# EAGLE design Charger_18V-1.35A_СС (EAGLE 8.5.0)
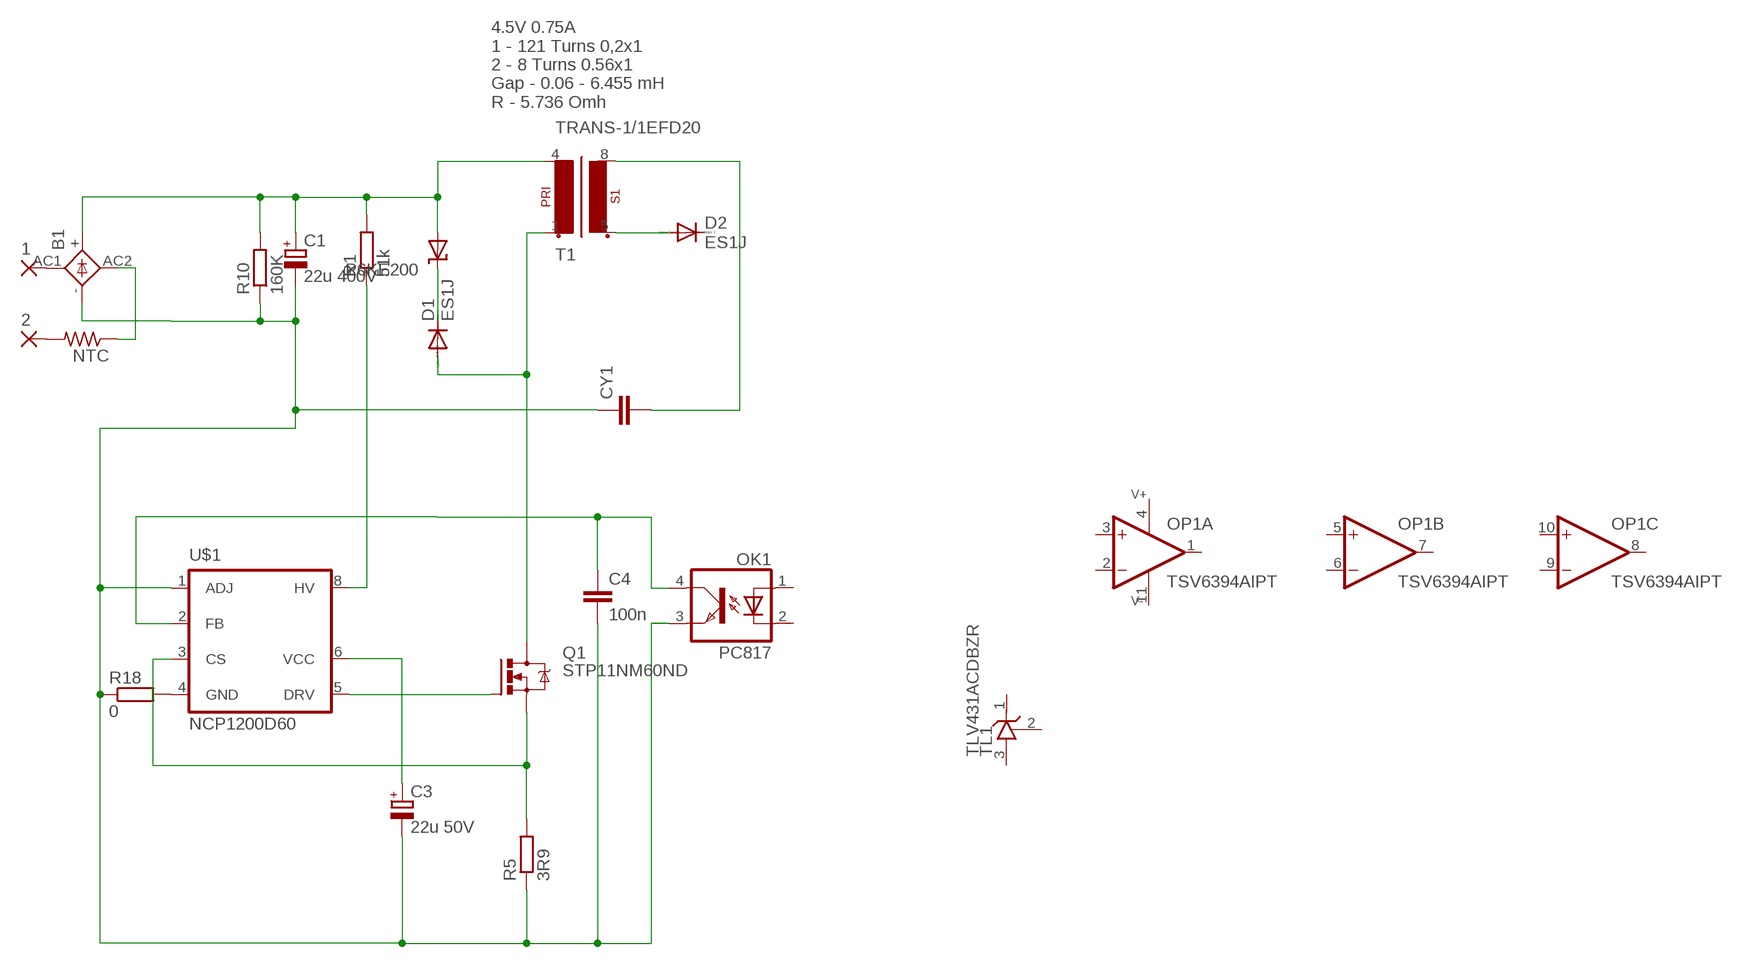
[diagram p0: schematic, sheet 1]

## Parts
1  3,81/1,4  [3,81/1,4]
2  3,81/1,4  [3,81/1,4]
B1  BRIDGEDBS  [DBS]
C1  22u 400V  CPOL-EUE7.5-18  [E7,5-18]
C3  22u 50V  CPOL-EUE5-5  [E5-5]
C4  100n  C-EUC0805  [C0805]
CY1  CYYC10B4  [YC10B4]
D1  ES1J  DIODE-DO-214AC  [DO-214AC]
D2  ES1J  DIODE-DO-214AC  [DO-214AC]
NTC  R-US_0207/7  [0207/7]
OK1  PC817  [DIL04]
OP1  TSV6394AIPT  OP-AMP-4LMV324IPT  [TSSOP14]
P6KE200  SUPRESSORDO-204AC  [DO15-12]
Q1  STP11NM60ND  IRF740  [TO220BV]
R1  51k  R_SQP-5  [SQP-5]
R5  3R9  R-EU_0309/12  [0309/12]
R10  160K  R-EU_0204/7  [0204/7]
R18  0  R-EU_R1206  [R1206]
T1  TRANS-1/1EFD20  [EFD20_8PIN]
TL1  TLV431ACDBZR  IC-TL431CDBZR  [SOT23]
U$1  NCP1200D60  NCP1200-100DIL  [DIP08]

## Nets
N$1: 2.1(P) NTC.2
N$2: D2.A T1.5(S1-1)
N$3: 1.1(P) B1.AC1
N$4: B1.AC2 NTC.1
N$5: C4.1 OK1.4(COL) U$1.2(FB)
N$6: B1.+ C1.+ P6KE200.A R1.2 R10.2 T1.4(P1-2)
N$7: D1.C P6KE200.C
N$8: D1.A Q1.D T1.1(P1-1)
N$10: R1.1 U$1.8(HV)
N$11: Q1.G U$1.5(DRV)
N$12: Q1.S R5.2 U$1.3(CS)
N$14: C3.+ U$1.6(VCC)
N$16: B1.- C1.- C3.- C4.2 CY1.1 OK1.3(EMIT) R5.1 R10.1 R18.1 U$1.1(ADJ)
N$23: CY1.2 T1.8(S1-2)
N$31: R18.2 U$1.4(GND)
Unconnected: D2.C OK1.1(A) OK1.2(C) OP1.1(A:OUT) OP1.2(A:-IN) OP1.3(A:+IN) OP1.5(B:+IN) OP1.6(B:-IN) OP1.7(B:OUT) OP1.8(C:OUT) OP1.9(C:-IN) OP1.10(C:+IN) OP1.12(D:+IN) OP1.13(D:-IN) OP1.14(D:OUT) TL1.1(C) TL1.2(R) TL1.3(A)

## Notes on the sheet
- 4.5V 0.75A
  1 - 121 Turns 0,2x1
  2 - 8 Turns 0.56x1
  Gap - 0.06 - 6.455 mH
  R - 5.736 Omh

## Power pins joined to a net without a drawn wire
V+: OP1.4(PW:V+)
V-: OP1.11(PW:V-)

## Library data of the parts
1 2 = wirepad:3,81/1,4: THROUGH-HOLE PAD
B1 = Namenlos:BRIDGE: GENERAL INSTRUMENT RECTIFIER
C1 C3 = rcl:CPOL-EU: POLARIZED CAPACITOR, European symbol
C4 = rcl:C-EU: CAPACITOR, European symbol
CY1 = rcl:CY: Y CAPACITOR for power line
D1 D2 = diode:DIODE-: DIODE
NTC = rcl:R-US_: RESISTOR, American symbol
OK1 = optocoupler:PC817: SHARP OPTO COUPLER; MPN: PC817X4J000F; OC_FARNELL: 9707727; OC_NEWARK: 97K7059
OP1 = Namenlos:OP-AMP-4
P6KE200 = Namenlos:SUPRESSOR
Q1 = transistor-power:IRF740: N-CHANNEL MOS FET
R1 = Namenlos:R_
R5 R10 R18 = rcl:R-EU_: RESISTOR, European symbol
T1 = Namenlos:TRANS-1/1
TL1 = Namenlos:IC-TL431
U$1 = NCP1200:NCP1200-100

## Board
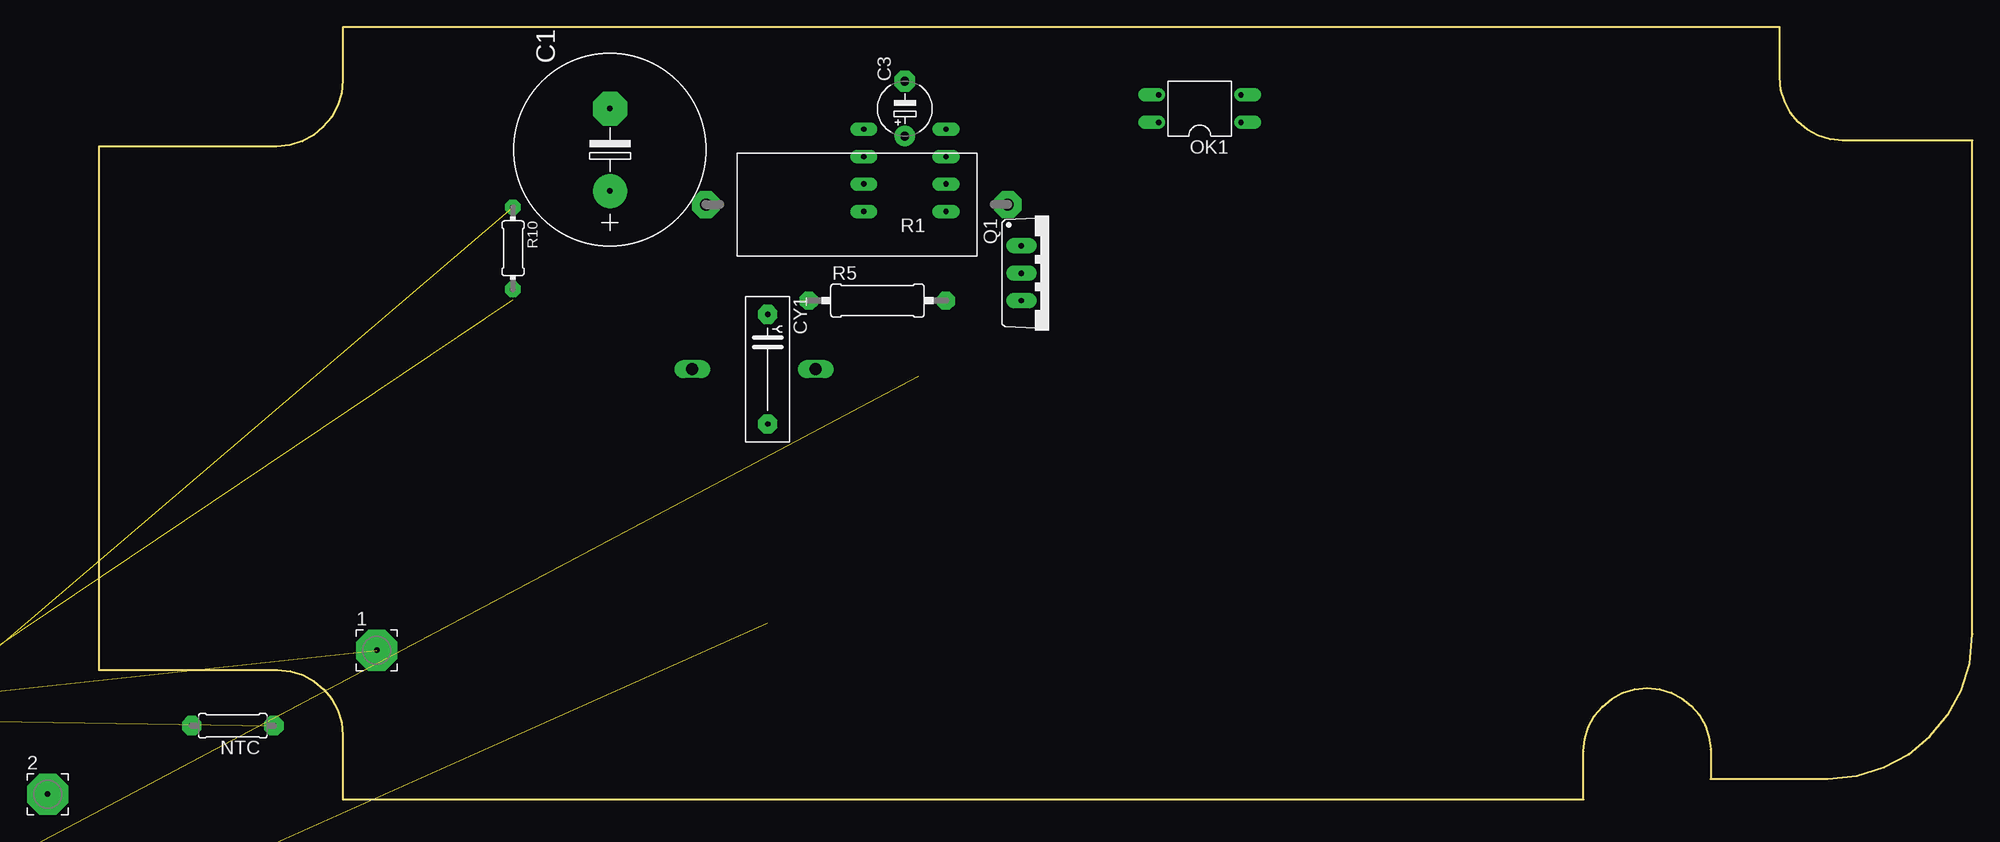
[diagram p1: board, top side]
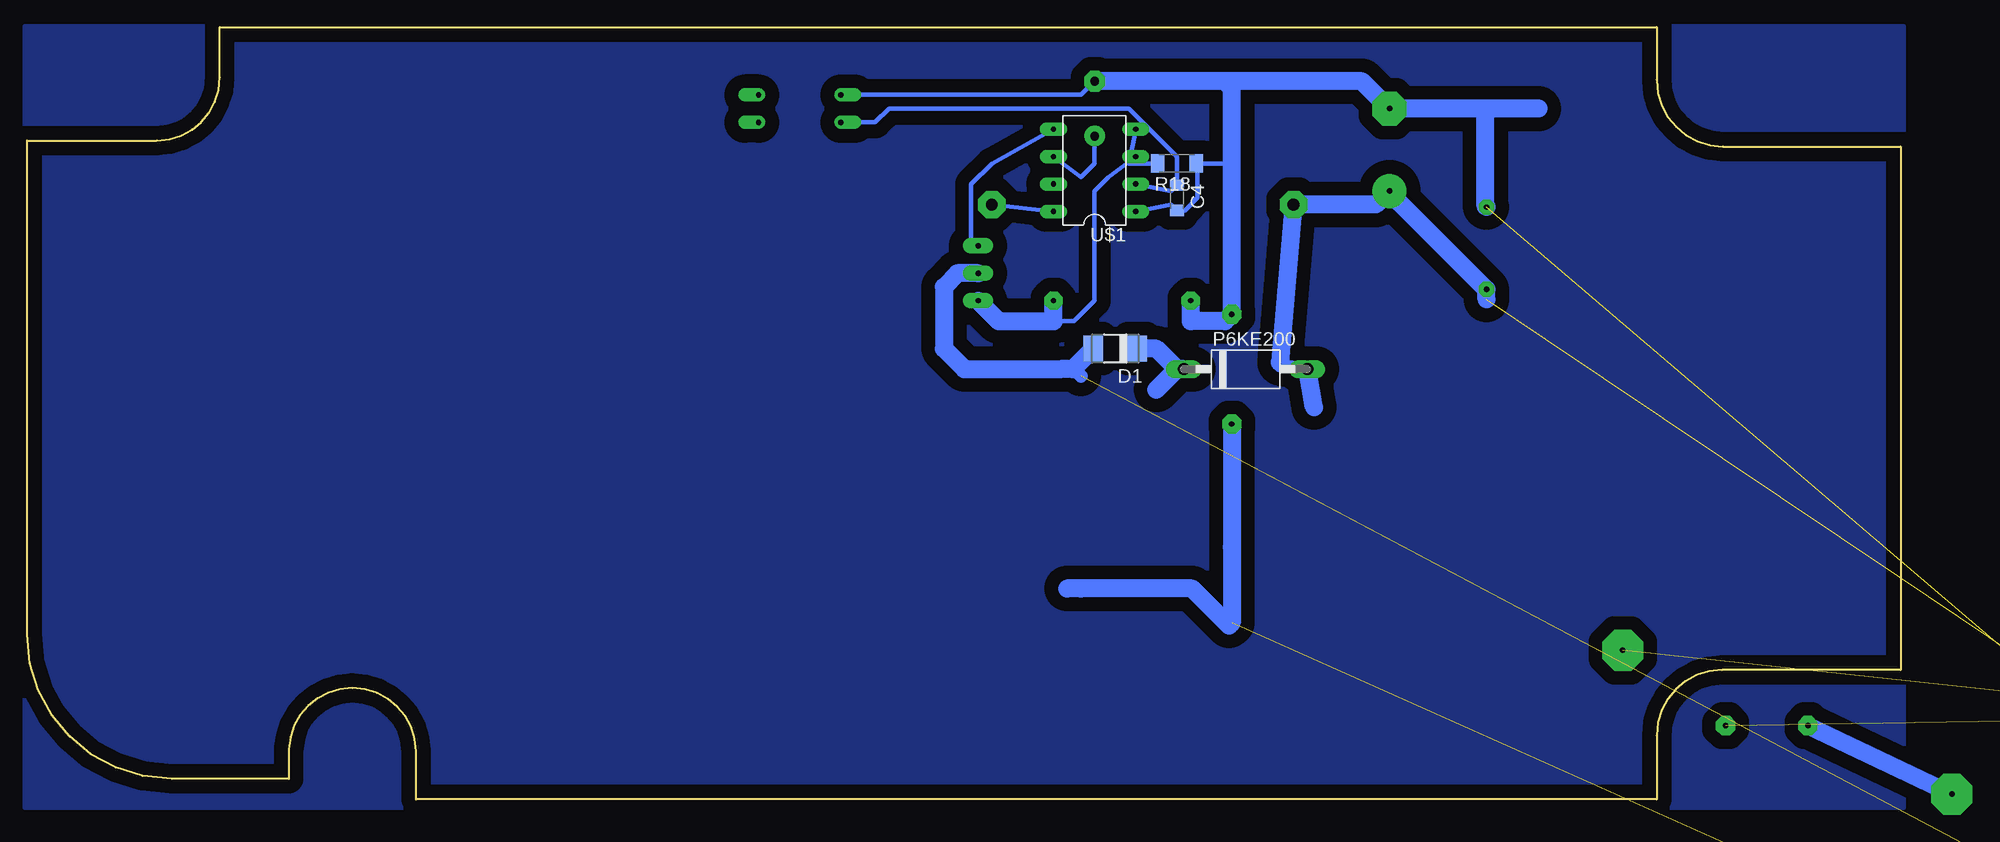
[diagram p2: board, bottom side, seen from below]

Size 173.48 x 71.54 mm. Coordinates in mm from the lower left corner, seen from the top.
Outline: 155.62,71.54 22.6,71.54 22.6,66.63 22.47,65.39 22.11,64.24 21.54,63.2 20.79,62.29 19.88,61.54 18.84,60.97 17.68,60.61 16.45,60.48 0,60.48 0,12 16.53,12 17.75,11.87 18.89,11.52 19.92,10.96 20.81,10.21 21.56,9.32 22.12,8.29 22.47,7.15 22.6,5.93 22.6,0 137.47,0 137.47,4.43 137.59,5.62 137.93,6.72 138.48,7.72 139.2,8.59 140.07,9.31 141.07,9.86 142.17,10.2 143.36,10.32 144.52,10.21 145.6,9.87 146.58,9.35 147.45,8.66 148.17,7.82 148.72,6.85 149.09,5.78 149.24,4.63 149.24,4.63 149.24,1.9 160.08,1.9 162.77,2.17 165.29,2.96 167.56,4.2 169.55,5.84 171.19,7.82 172.42,10.1 173.21,12.61 173.48,15.3 173.48,61.03 161.46,61.03 160.29,61.15 159.19,61.49 158.2,62.03 157.34,62.75 156.62,63.61 156.08,64.61 155.74,65.7 155.62,66.87 155.62,71.54
Copper layers (1*16): Top 0.035mm / dielectric 1.5mm / Bottom 0.035mm
Design rules "default": minimum track width 10mil, minimum drill 24mil, track to track 8mil, track to pad 8mil, pad to pad 8mil, via to via 8mil, smd to smd 8mil, copper to edge 40mil, drill to drill 8mil, minimum pad ring 10mil, minimum via ring 8mil, stop-mask expansion 4mil, vias tented up to drill 0mil, thermal gap 10mil

### Footprints (pad centres in the part's own frame; a part is rotated, then mirrored left to right if it is on the bottom)
3,81/1,4 = drill 0.5 pad 3.81 octagon: 1 0,0
DBS = smd 1.7 x 1.9: + -2.55,-4.5; - 2.55,-4.5; AC1 -2.55,4.5; AC2 2.55,4.5
E7,5-18 = drill 0.5 pad 3.15: + -3.81,0 | drill 0.5 pad 3.15 octagon: - 3.81,0
E5-5 = drill 0.813 pad 1.905: + -2.54,0 | drill 0.813 pad 1.905 octagon: - 2.54,0
C0805 = smd 1.05 x 1.3: 1 -1.175,0; 2 1.175,0
YC10B4 = drill 0.5 pad 1.778 octagon: 1 -5.08,0; 2 5.08,0
DO-214AC = smd 1.8 x 2.4: A 2.025,0; C -2.025,0
0207/7 = drill 0.5 pad 1.778 octagon: 1 -3.81,0; 2 3.81,0
DIL04 = drill 0.5 pad 1.27 offset: 1 -1.27,-3.81; 2 1.27,-3.81; 3 1.27,3.81; 4 -1.27,3.81
TSSOP14 = smd 0.305 x 0.991: 1 -1.95,-2.918; 2 -1.3,-2.918; 3 -0.65,-2.918; 4 0,-2.918; 5 0.65,-2.918; 6 1.3,-2.918; 7 1.95,-2.918; 8 1.95,2.918; 9 1.3,2.918; 10 0.65,2.918; 11 0,2.918; 12 -0.65,2.918; 13 -1.3,2.918; 14 -1.95,2.918
DO15-12 = drill 1.1 pad 1.676 long: A 5.08,0; C -6.35,0
TO220BV = drill 0.5 pad 1.422 long: D 0,-2.54; G -2.54,-2.54; S 2.54,-2.54
SQP-5 = drill 1.1 pad 2.54 octagon: 1 -13.97,0; 2 13.97,0
0309/12 = drill 0.5 pad 1.676 octagon: 1 -6.35,0; 2 6.35,0
0204/7 = drill 0.5 pad 1.422 octagon: 1 -3.81,0; 2 3.81,0
R1206 = smd 1.25 x 1.7: 1 -1.775,0; 2 1.775,0
EFD20_8PIN = drill 1.1 pad 1.93 octagon: 1 -9,7.62; 2 -9,2.54; 3 -9,-2.54; 4 -9,-7.62; 5 9,-7.62; 6 9,-2.54; 7 9,2.54; 8 9,7.62
SOT23 = smd 1 x 1.4: 1 -0.95,-1.1; 2 0.95,-1.1; 3 0,1.1
DIP08 = drill 0.5 pad 1.27 long: 1 -2.54,-3.81; 2 0,-3.81; 3 2.54,-3.81; 4 5.08,-3.81; 5 5.08,3.81; 6 2.54,3.81; 7 0,3.81; 8 -2.54,3.81

### Placement (x,y rotation side)
1  25.73,13.82 0 top
2  -4.75,0.48 0 top  (outside the outline)
B1  -30.15,3.02 0 top  (outside the outline)
C1  47.32,60.17 90 top
C3  74.63,63.98 90 top
C4  67.01,55.73 270 bottom
CY1  61.93,39.85 270 top
D1  72.72,41.76 180 bottom
D2  -19.35,-0.79 0 top  (outside the outline)
NTC  12.4,6.83 180 top
OK1  101.93,63.98 90 top
OP1  -41.58,-35.71 0 top  (outside the outline)
P6KE200  60.02,39.85 0 bottom
Q1  87.96,48.74 270 top
R1  70.18,55.09 180 top
R5  72.09,46.2 0 top
R10  38.35,51.05 270 top
R18  67.01,58.9 180 bottom
T1  -18.08,-23.01 0 top  (outside the outline)
TL1  -42.85,-43.97 0 top  (outside the outline)
U$1  74.63,57 90 bottom

### Tracks (layer width: path | path; a pad name or v marks a point on that pad's centre or on a via)
N$1
  Bottom 1.676: 2.1 NTC.2
N$2  (1 unrouted)
N$3  (1 unrouted)
N$4  (1 unrouted)
N$5
  Bottom 0.406: U$1.2 67.56,56.35 C4.1 67.01,59.54 71.45,63.98 89.87,63.98 93.68,63.98 94.95,62.71 OK1.4
N$6  (2 unrouted)
  Bottom 1.27: 57.48,40.49 57.48,40.19 P6KE200.A
  Bottom 1.676: 57.48,40.49 R1.2 48.59,55.09 C1.+ 47.32,56.21 R10.2 38.35,46.3 | 54.31,36.34 P6KE200.A
N$7
  Bottom 1.676: P6KE200.C 67.01,39.85 | 67.01,39.85 68.91,41.76 D1.C | 68.91,37.95 67.01,39.85
N$8  (1 unrouted)
  Bottom 1.27: 76.65,39.85 76.59,39.91 75.9,39.22
  Bottom 1.676: Q1.D 87.33,48.74 88.6,47.47 88.6,41.76 86.69,39.85 77.8,39.85 76.65,39.85 | D1.A 76.59,39.91
N$10
  Bottom 0.406: U$1.8 R1.1
N$11
  Bottom 0.406: U$1.5 84.15,58.9 86.06,57 86.06,51.92 Q1.G
N$12
  Bottom 0.406: U$1.3 73.37,57.62 74.63,56.36 74.63,46.2 76.53,44.3 78.44,44.3
  Bottom 1.676: R5.2 78.44,44.3 83.52,44.3 Q1.S
N$14
  Bottom 0.406: C3.+ 74.63,58.9 75.9,57.63 U$1.6
N$16  (1 unrouted)
  Bottom 0.406: C3.- 75.9,65.25 90.5,65.25 OK1.3 | U$1.1 67.55,55.09 C4.2 66.28,54.55 65.1,55.73 65.1,58.77 R18.1 61.93,58.9
  Bottom 1.676: 33.53,63.98 38.43,63.98 | 38.43,63.98 C1.- 49.86,66.52 62.56,66.52 | R10.1 38.43,54.94 38.43,63.98 | 62.56,66.52 C3.- | R5.1 65.74,44.3 62.56,44.3 CY1.1 61.93,58.9 61.93,65.89 62.56,66.52
N$22
  pour Bottom (isolate 1.27): -0.3,-0.79 -0.3,71.6 155.91,71.6 173.69,71.6 173.69,18.26 173.69,-0.79
N$23  (1 unrouted)
  Bottom 1.676: 77.17,19.53 75.9,19.53 65.6,19.53 62.18,16.11 61.93,16.36 61.93,23.34 CY1.2
N$31
  Bottom 0.406: R18.2 71.46,58.9 U$1.4